# EasyEDA schematic Electronics Sensor& Modules.json

## Sheets
1 3x3 KeyPad: TITLE: Sheet_1; REV: 1.0; Date: 2023-11-17; Sheet: 1/1; Company: Your Company
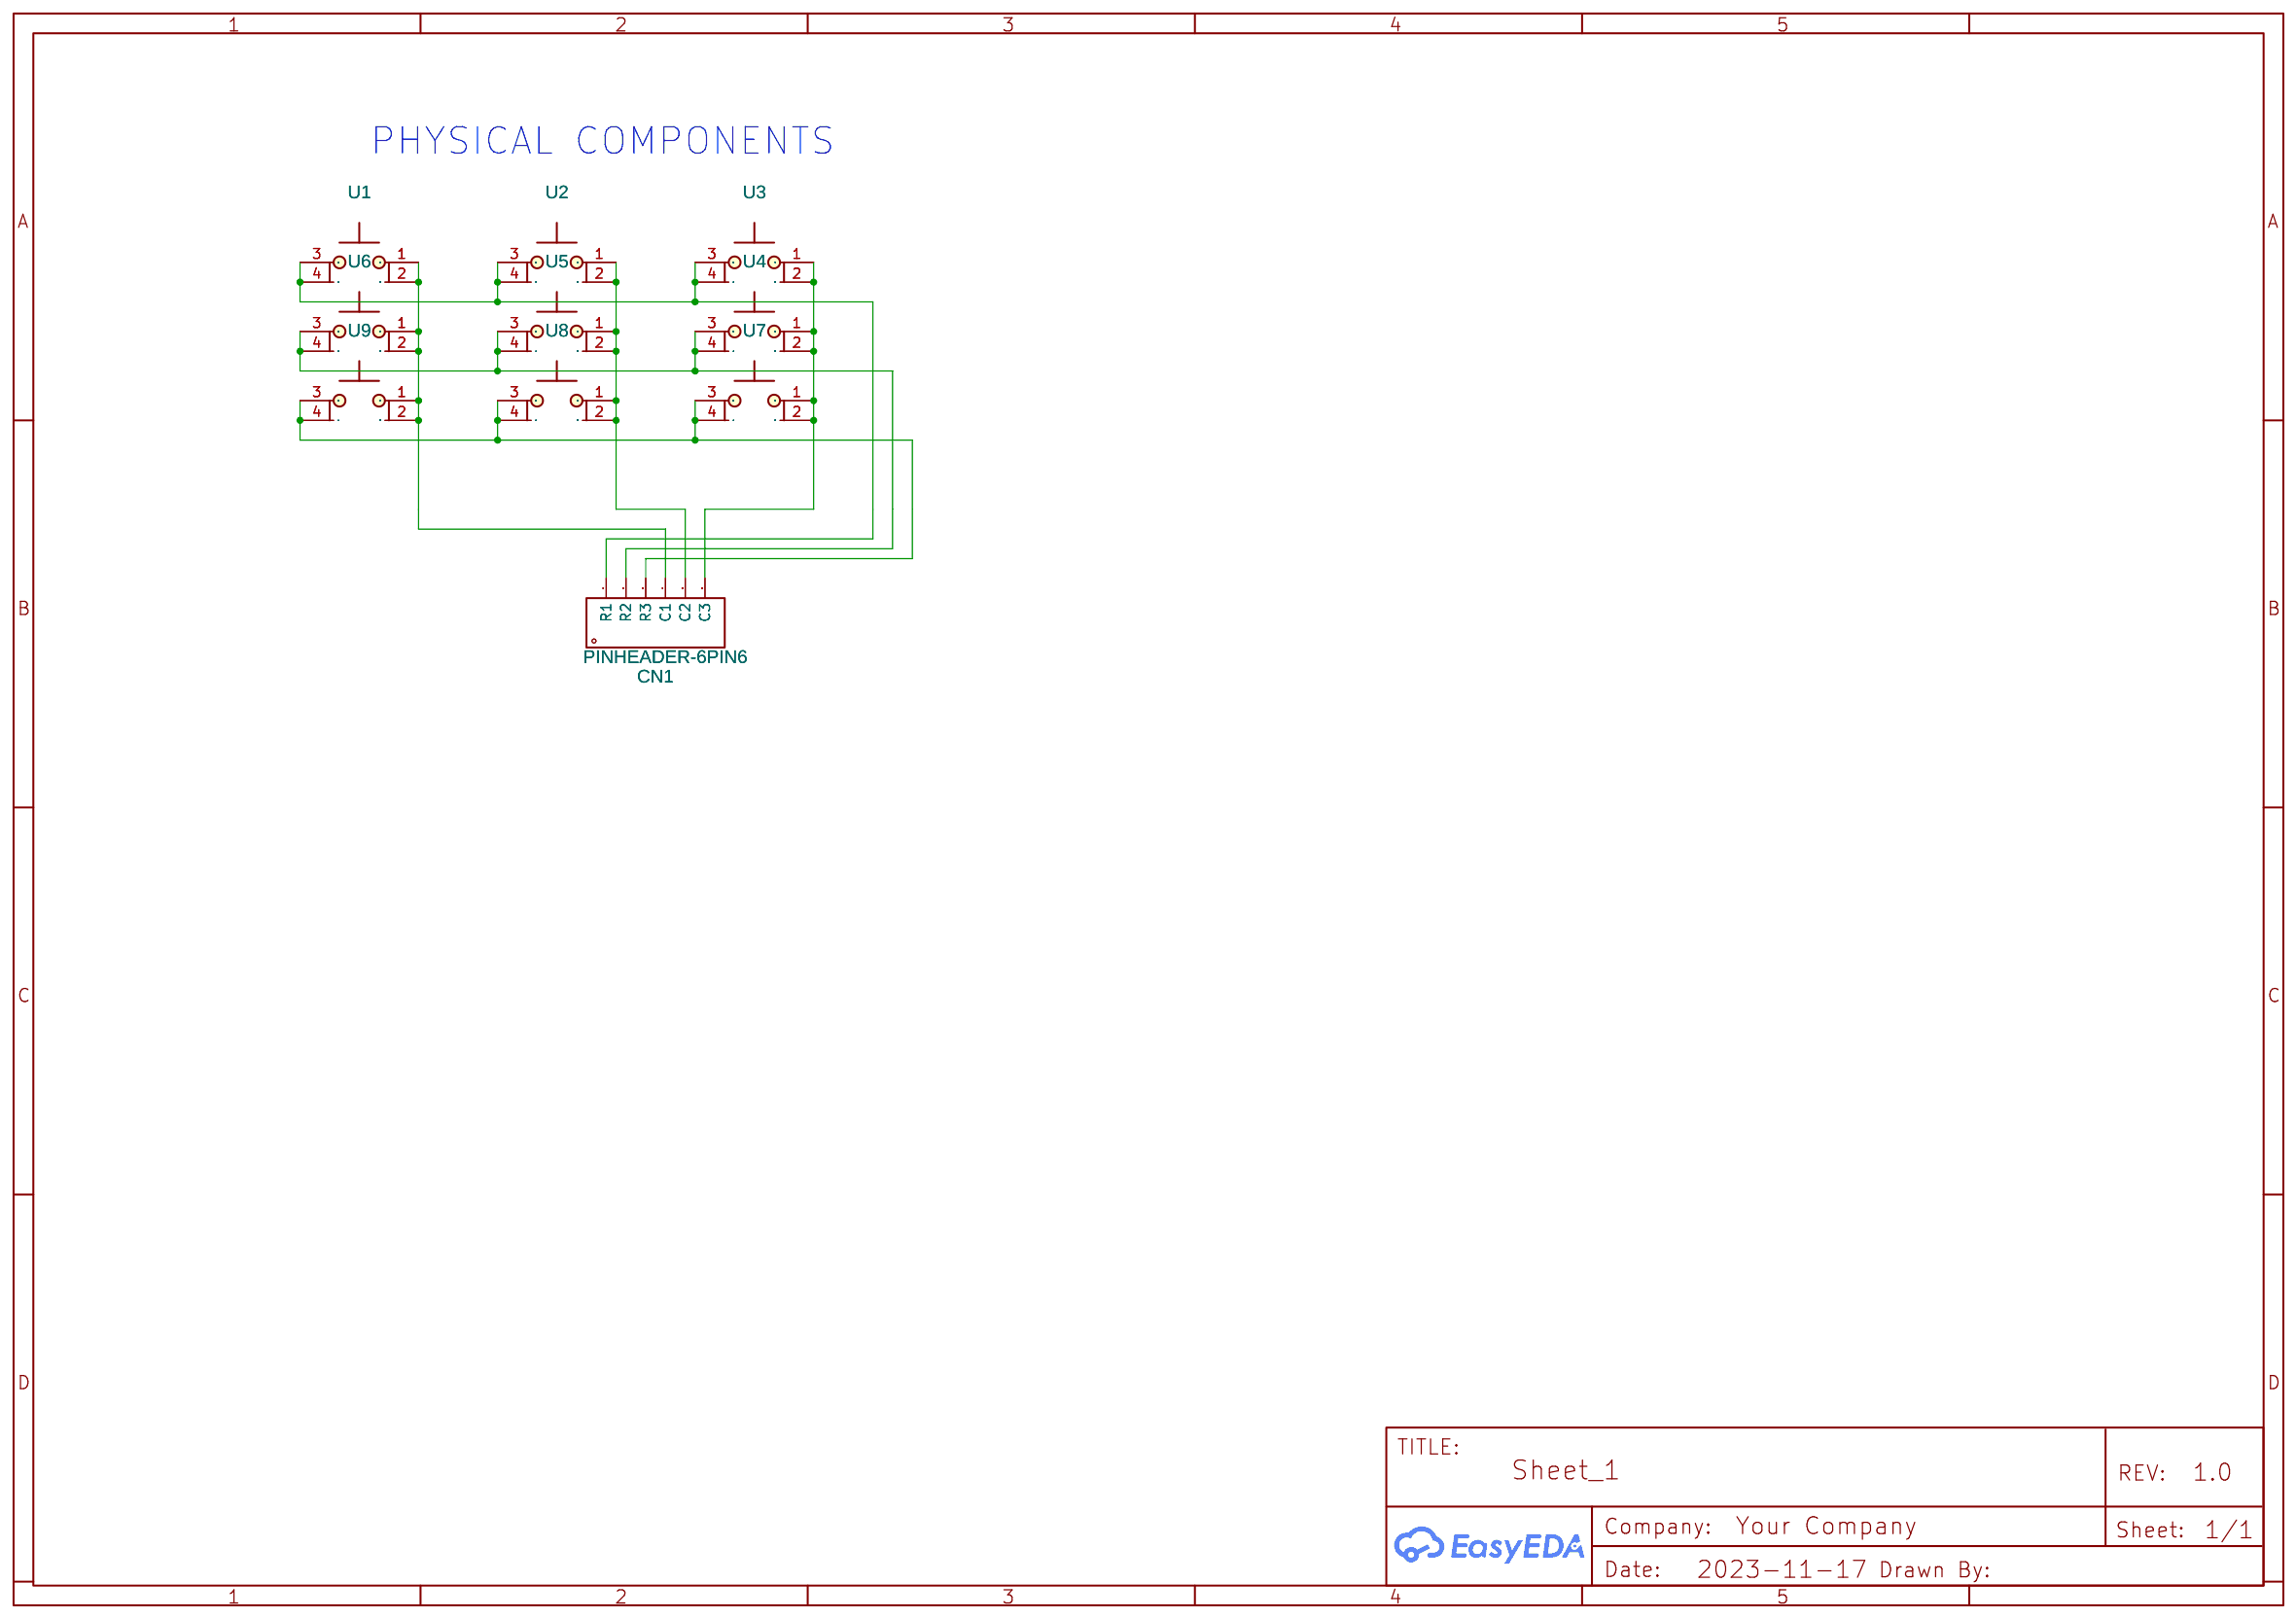
[diagram p0: 3x3 KeyPad]
2 EM-18 Module
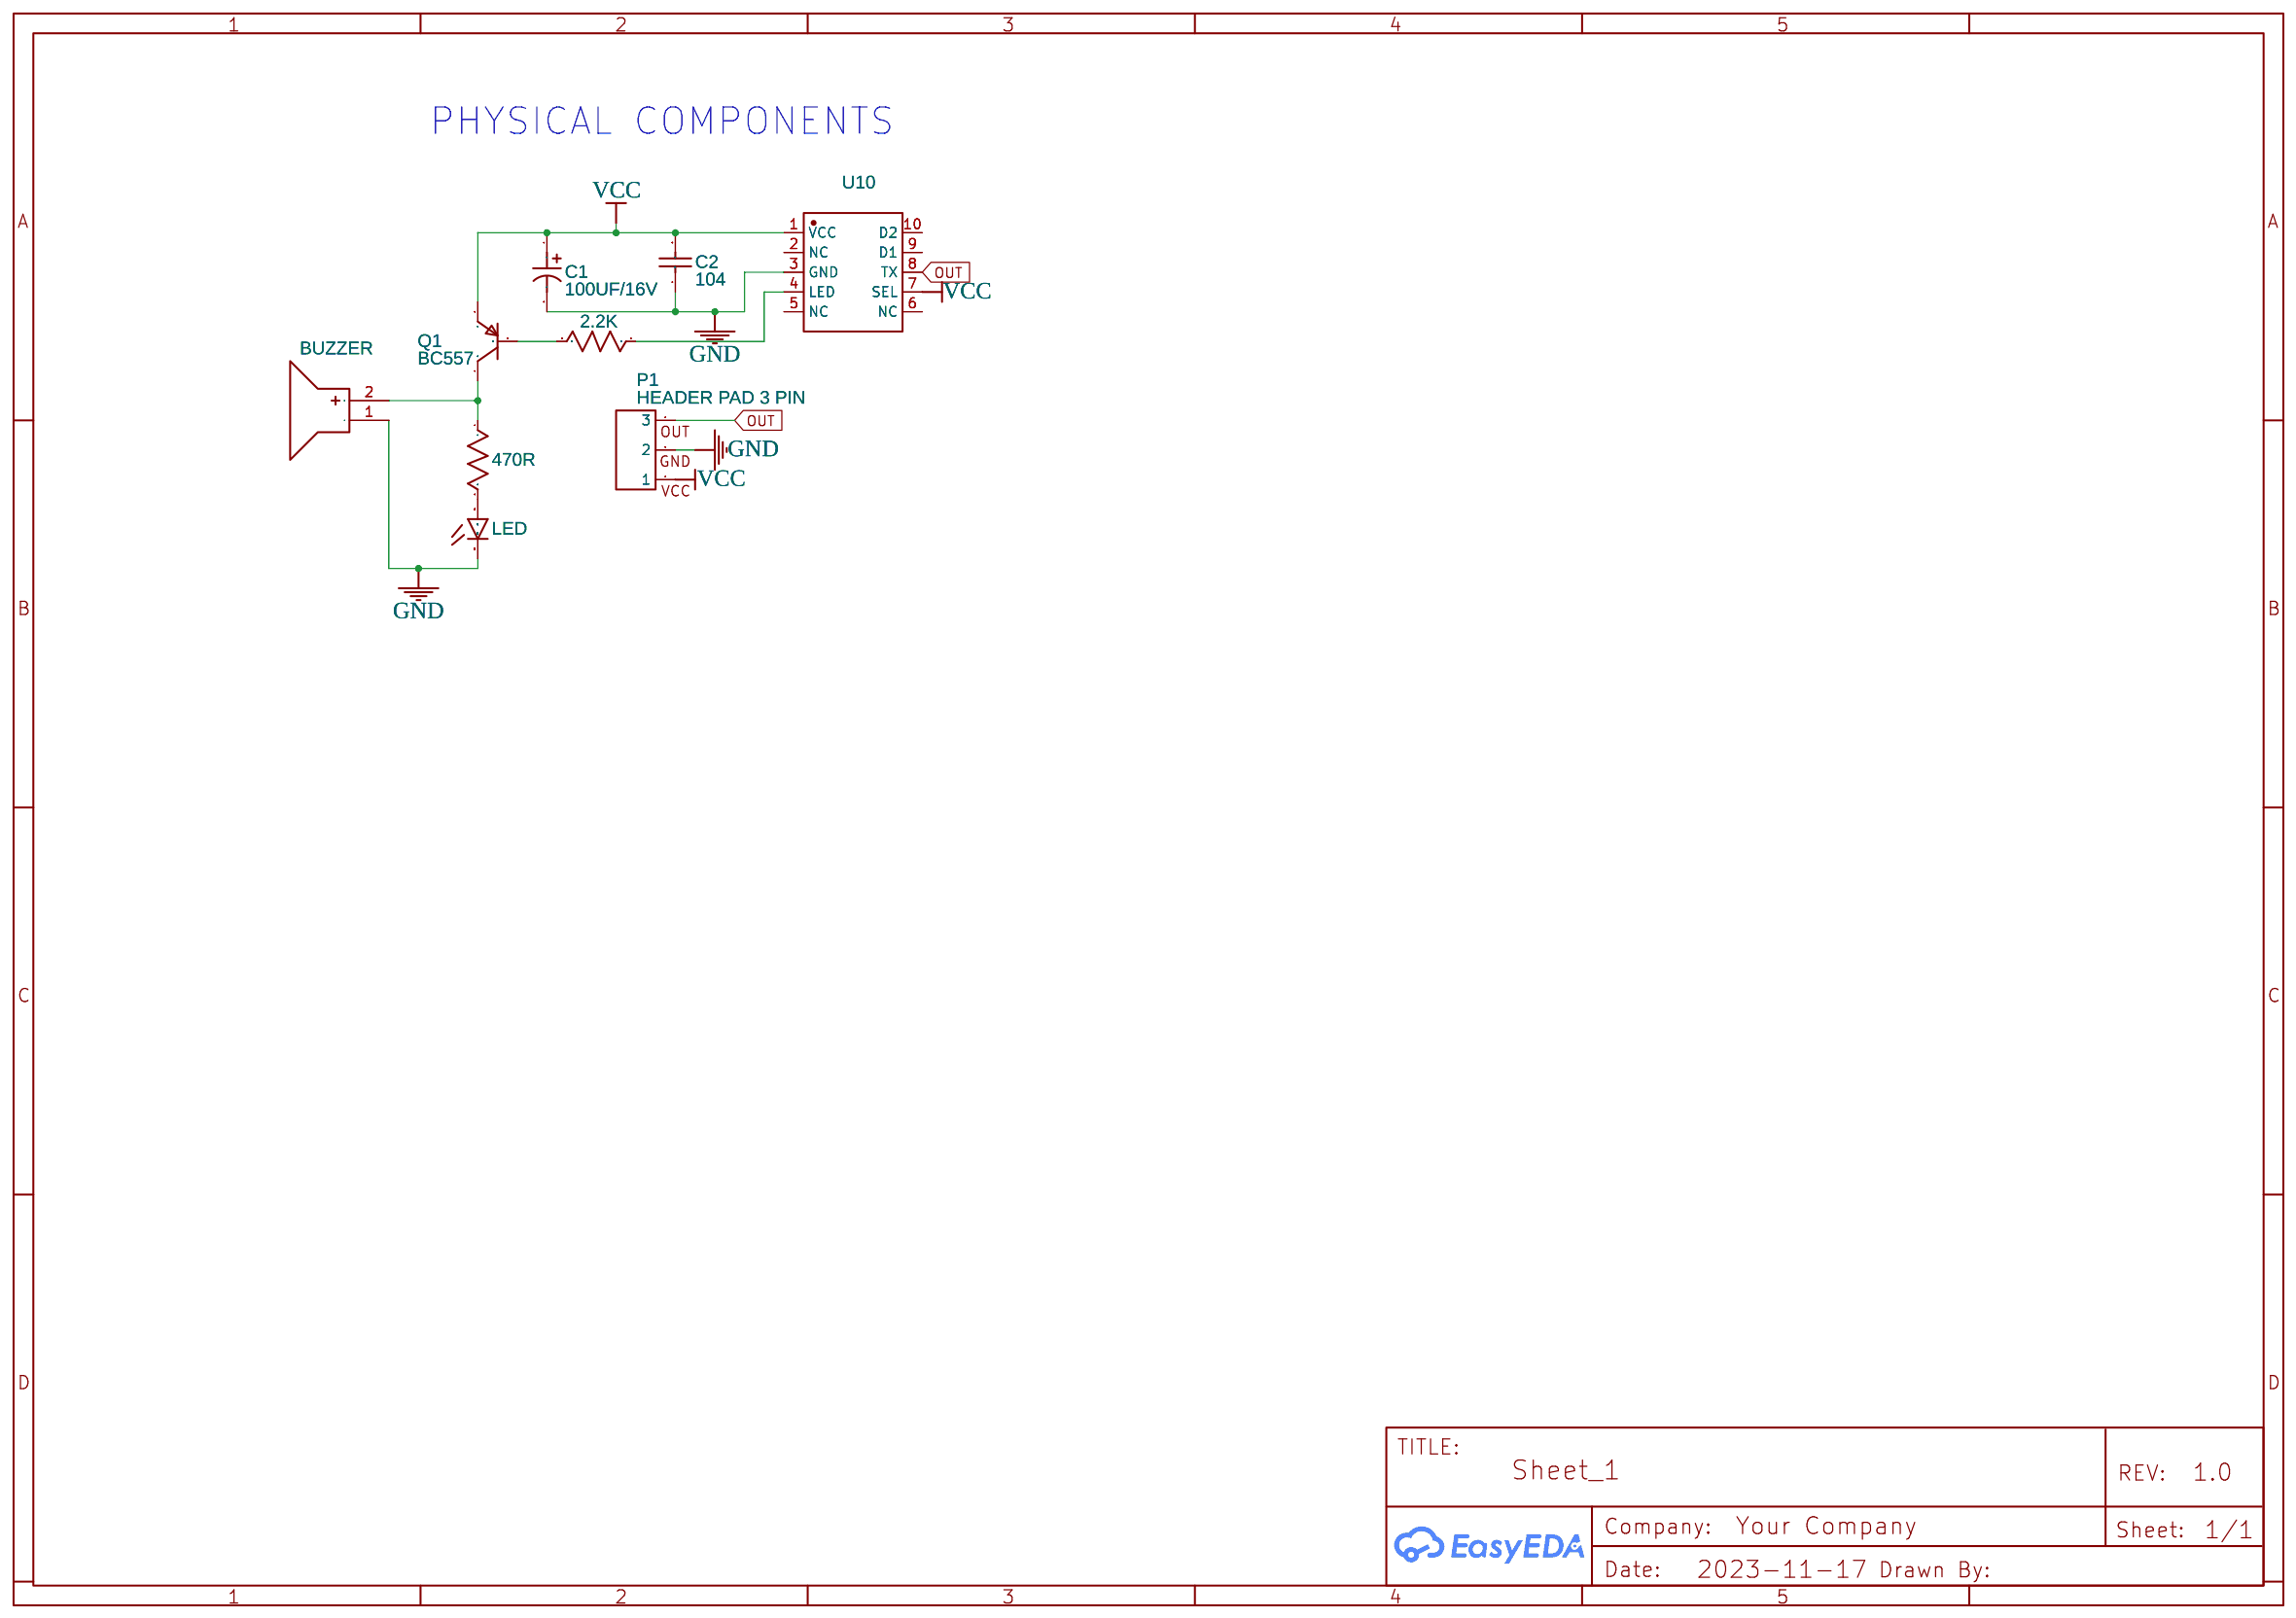
[diagram p1: EM-18 Module]
3 Relay Module
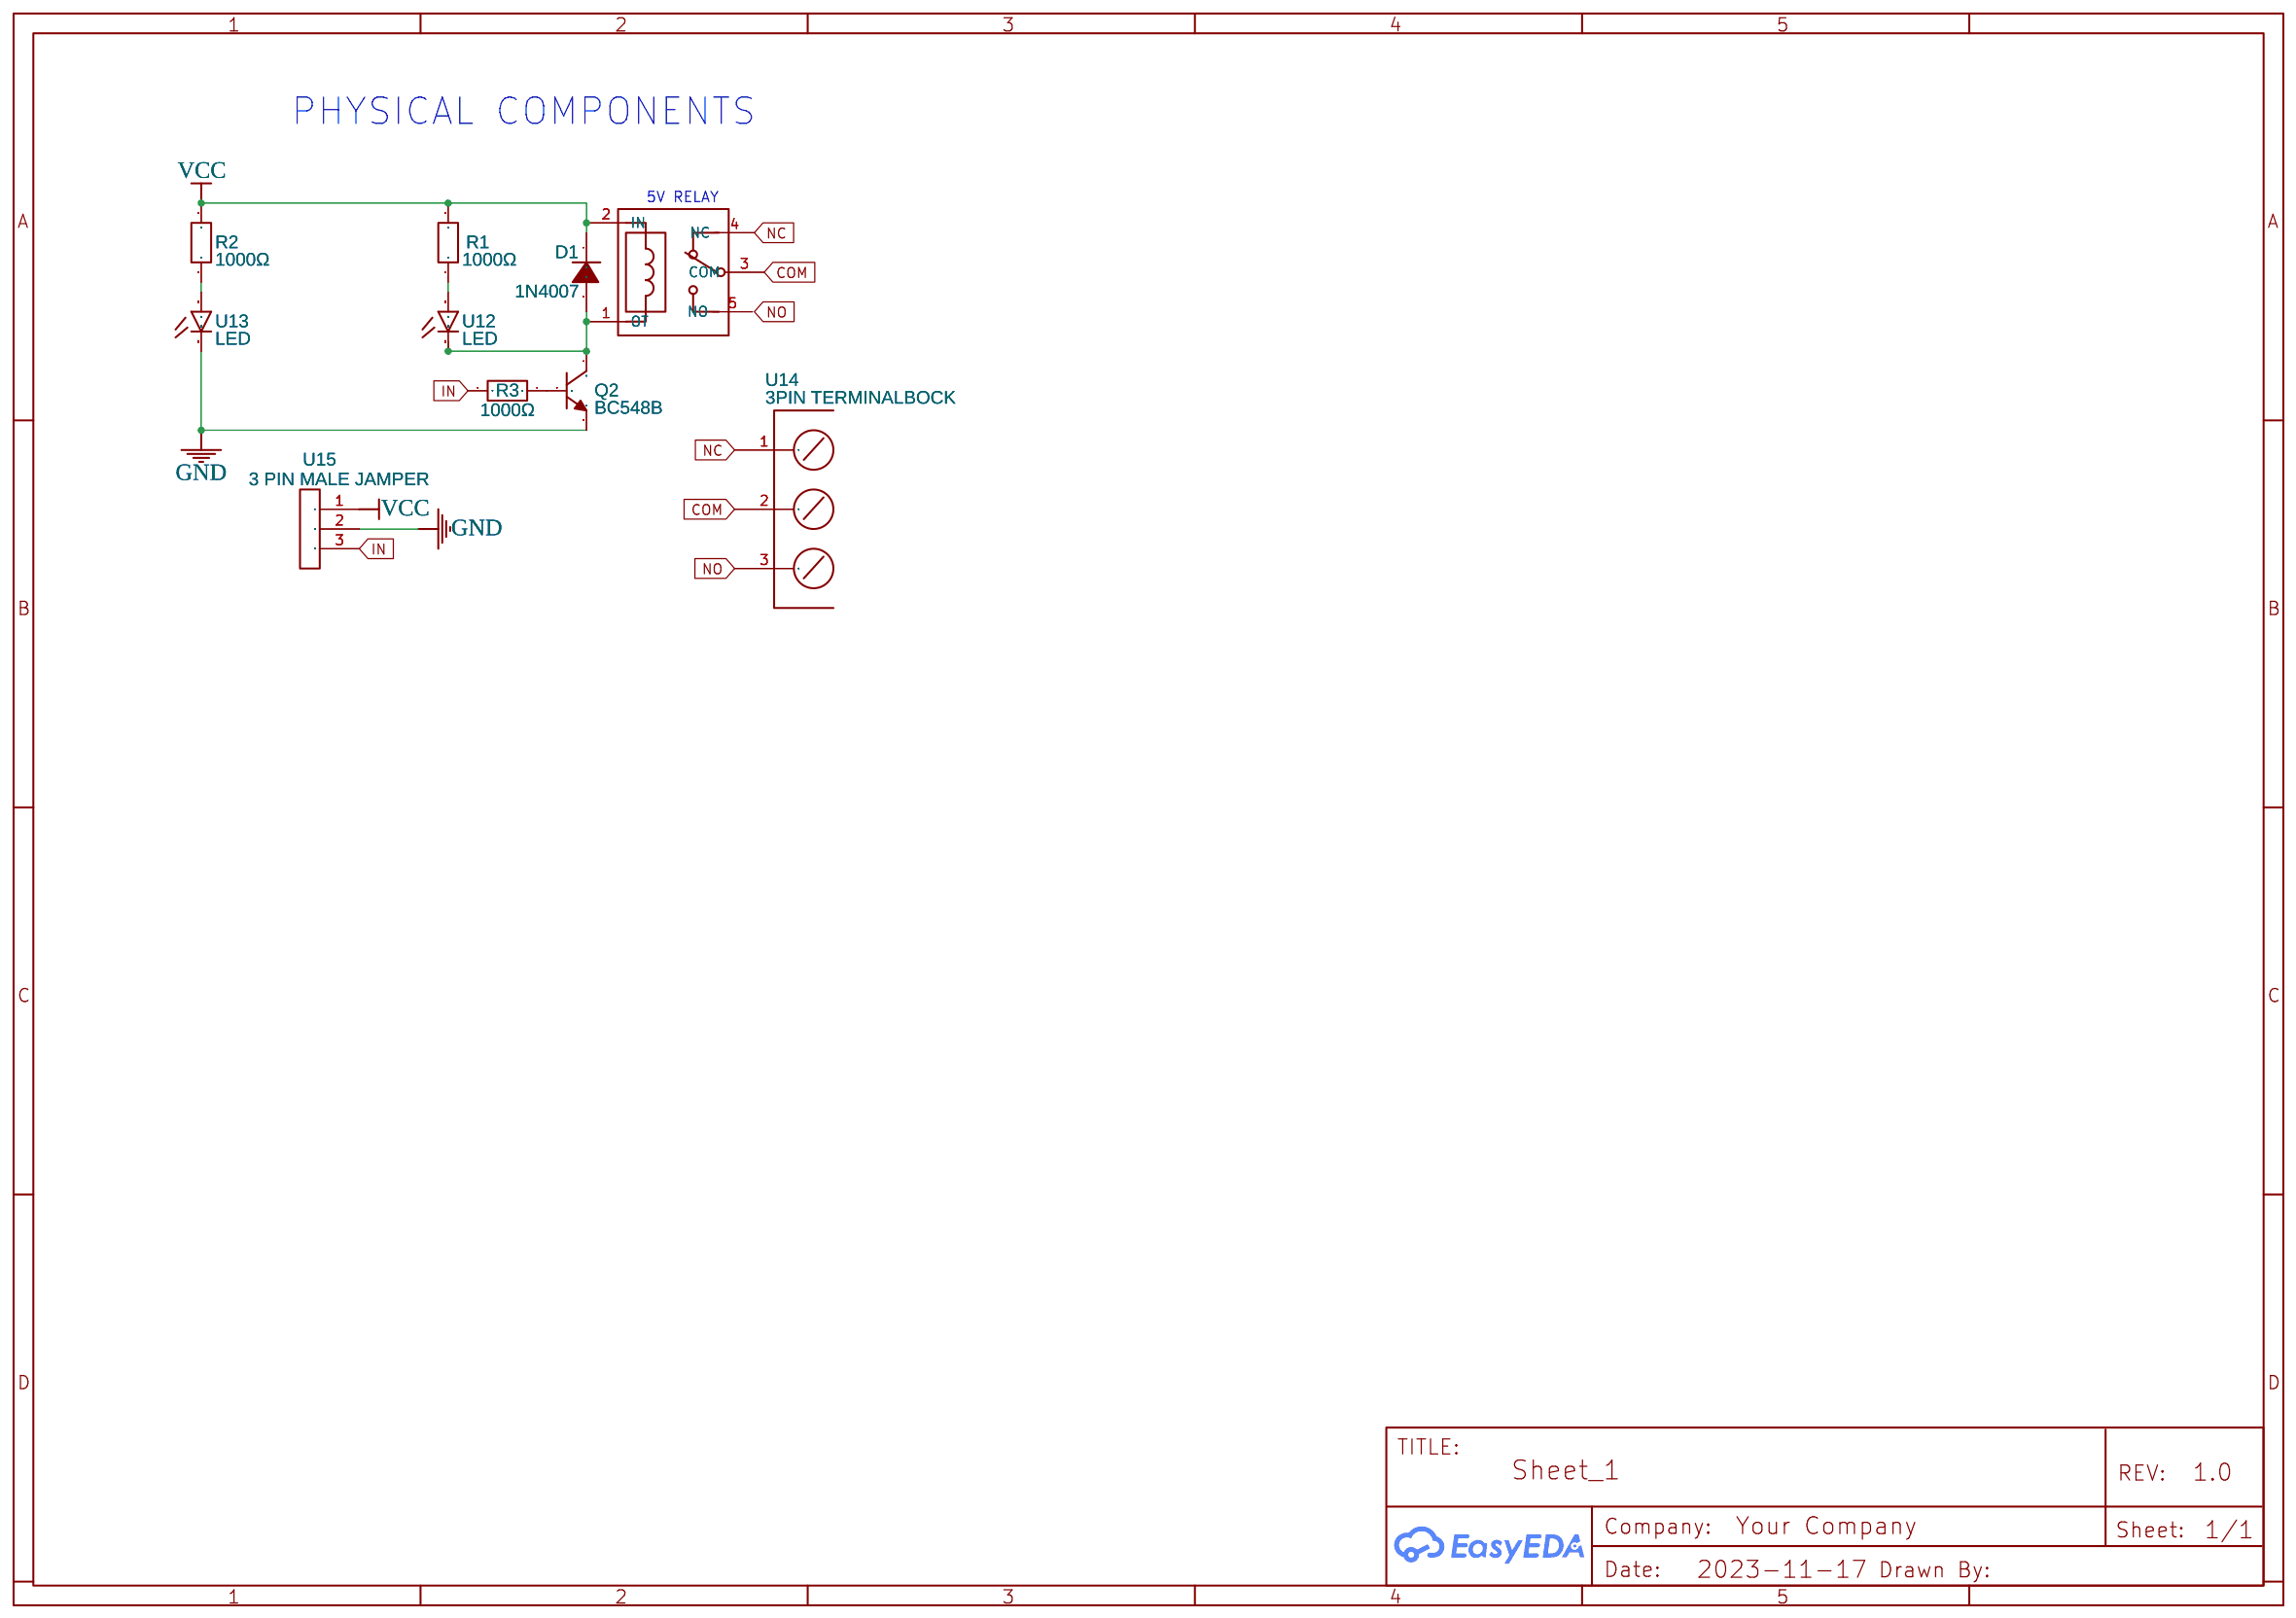
[diagram p2: Relay Module]
4 16x2 LCD Display: Date: 2023-11-18
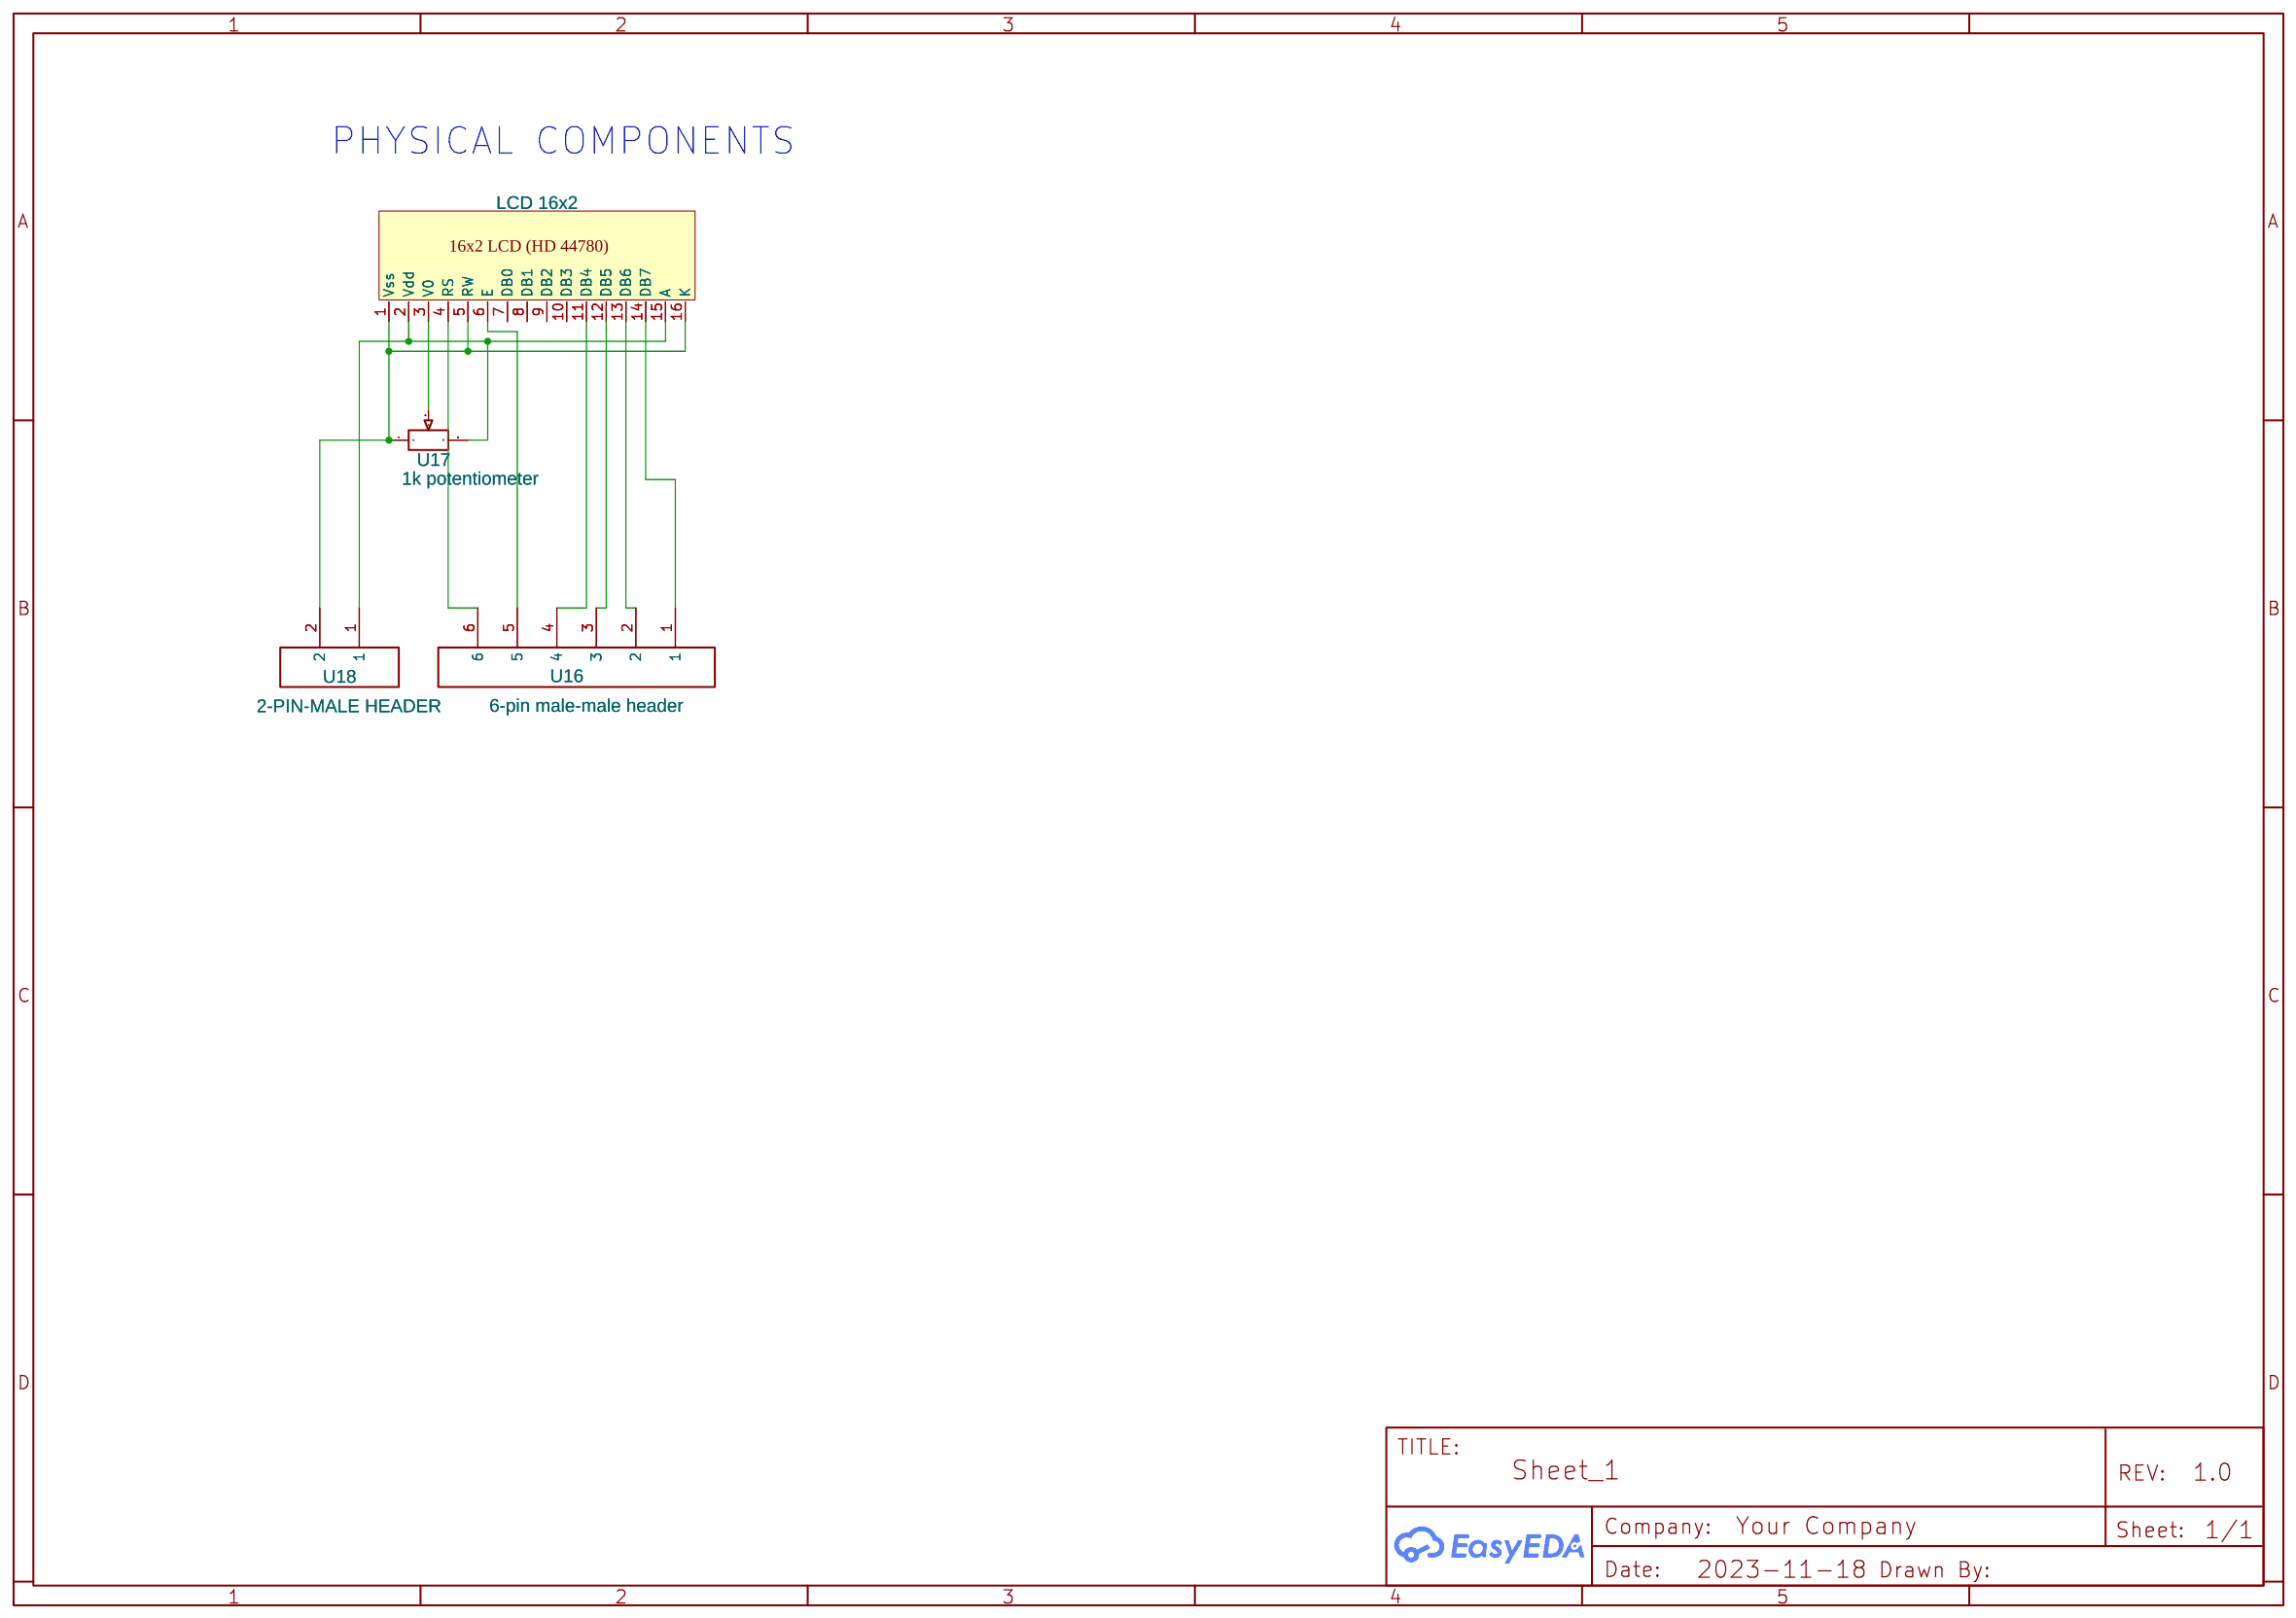
[diagram p3: 16x2 LCD Display]

## Parts
sheet 3x3 KeyPad
CN1  PINHEADER-6PIN6  [PINHEADER-6PIN]
U1  -  [MICROSWITCH]
U2  -  [MICROSWITCH]
U3  -  [MICROSWITCH]
U4  -  [MICROSWITCH]
U5  -  [MICROSWITCH]
U6  -  [MICROSWITCH]
U7  -  [MICROSWITCH]
U8  -  [MICROSWITCH]
U9  -  [MICROSWITCH]
sheet 16x2 LCD Display
LCD1  LCD 16x2  [CLASE10LCD16X2]
U16  6-pin male-male header  [5-PIN MALE-MALE HEADER]
U17  1k potentiometer  [POTENTIOMETER BLUE]
U18  2-PIN-MALE HEADER  [2PIN-MALE HEADER]
sheet EM-18 Module
2.2K  -  [2.2K METAL FILM 1/4W RESISTOR]
470R  -  [2.2K METAL FILM 1/4W RESISTOR]
BUZZER1  BUZZER  [BUZ-TH_BD12.0-P6.00-D0.9-RD]
C1  100UF/16V  [CAP-TH_BD6.3-P2.50-D0.5-FD]
C2  104  [NP CAP-8*3.5-5.08MM]
LED  -  [LED5]
P1  HEADER PAD 3 PIN  [CONNECTOR_PINHEADER_2.54MM:PINHEADER_1X3]
Q1  BC557  [TO-92-3_L4.9-W3.7-P1.27-R]
U10  -  [EM_18]
sheet Relay Module
D1  1N4007  [DO-41_BD2.4-L4.7-P8.70-D0.9-RD]
Q2  BC548B  [TO-92-3_L4.9-W3.7-P1.27-L]
R1  1000Ω  [330Ω RESISTANCE]
R2  1000Ω  [330Ω RESISTANCE]
R3  1000Ω  [330Ω RESISTANCE]
U11  -  [RELAY-TH_SRD-XXVDC-XL-C]
U12  LED  [LED5]
U13  LED  [LED5]
U14  3PIN TERMINALBOCK  [5A_3PIN-TERMINALBLOCK]
U15  3 PIN MALE JAMPER  [3PIN FEMALE HEADER]

## Library data of the parts
CN1 = PINHEADER-6PIN6: Contributor: tiennguyenanh1
U1-U9 = ESO_SPST_Momentary: Contributor: LuckyStiff63; sourceId: F4cICwqI0
LCD1 = LCD 16x2: Contributor: yutthanasing
U16 = 6-pin male-male header: Manufacturer: TE Connectivity; Manufacturer Part: 87224-5; Supplier Part: A26549-ND; link: https://www.digikey.com/en/products/detail/te-connectivity-amp-connectors/87224-5/295324?utm_adgroup=Essen%20Deinki&utm_source=google&utm_medium=cpc&utm_campaign=Shopping_DK%2BSupplier_Other&utm_term=&utm_content=Essen%20Deinki&gclid=EAIaIQobChMIl76j1KPQ9wIVirfICh1BfwQCEAQYASABEgL9fPD_BwE; Contributor: Soumarya
U17 = Pot_blue: Supplier Part: C61836; Contributor: Dennis van der Velde; Convert to PCB: Yes; Add into BOM: Yes
U18 = 2-PIN-MALE HEADER: Manufacturer: TE Connectivity; Manufacturer Part: 87224-5; Supplier Part: A26549-ND; link: https://www.digikey.com/en/products/detail/te-connectivity-amp-connectors/87224-5/295324?utm_adgroup=Essen%20Deinki&utm_source=google&utm_medium=cpc&utm_campaign=Shopping_DK%2BSupplier_Other&utm_term=&utm_content=Essen%20Deinki&gclid=EAIaIQobChMIl76j1KPQ9wIVirfICh1BfwQCEAQYASABEgL9fPD_BwE; Contributor: Soumarya
2.2K 470R = 1/4W-2.2KΩ±1%: Manufacturer: Huaxing Mechanical-Elec.; Supplier: LCSC; Supplier Part: C714002; Contributor: jellybeanstaffy; Convert to PCB: Yes; Add into BOM: Yes
BUZZER1 = BUZZER: Contributor: lcsc; Supplier: LCSC; Supplier Part: C9900014030; Manufacturer: null; Manufacturer Part: buzzer; JLCPCB Part Class: Extended Part; link: https://lcsc.com/eda_search?q=C9900014030&%26type=1&ref=editor
C1 = 100UF/16V: Supplier: LCSC; Supplier Part: C9900021331; Manufacturer: null; Manufacturer Part: 100uF/16V; JLCPCB Part Class: Extended Part; Contributor: lcsc
C2 = 104nf: Supplier: LCSC; Manufacturer: ReliaPro; Manufacturer Part: Suppression Capacitor222M/250V; Supplier Part: C46751; Contributor: sunbin
LED U12 U13 = -LED
P1 = HEADER PAD 3 PIN: Supplier: LCSC; Manufacturer: BOOMELE; Manufacturer Part: Female headerHDR1X8-2.54; Supplier Part: C27438; JLCPCB Part Class: Extended Part; Contributor: vincentboisselier
Q1 = BC557: Contributor: LCSC; Supplier Part: C180418; Supplier: LCSC; Manufacturer: CJ(江苏长电/长晶); JLCPCB Part Class: Extended Part; link: https://lcsc.com/eda_search?q=C180418&%26type=1&ref=editor
U10 = EM-18: Contributor: muhammedimdaad16
D1 = 1N4007: Supplier: LCSC; Manufacturer: ST(先科); Supplier Part: C106903; JLCPCB Part Class: Extended Part; link: https://lcsc.com/eda_search?q=C106903&%26type=1&ref=editor
Q2 = BC548B: Supplier: LCSC; Manufacturer: CJ(江苏长电/长晶); Manufacturer Part: BC548; Supplier Part: C36611; JLCPCB Part Class: Extended Part; link: https://lcsc.com/eda_search?q=C36611&%26type=1&ref=editor
R1-R3 = 330Ω RESISTANCE: Supplier Part: C410657; Supplier: LCSC; Contributor: pritams07
U11 = SRD-05VDC-SL-C: Supplier: LCSC; Manufacturer: 松乐; Supplier Part: C35449; JLCPCB Part Class: Extended Part; Contributor: danishjr.hd
U14 = 3PIN TERMINALBOCK: Contributor: abdullahsesli
U15 = 3 PIN MALE JAMPER: Manufacturer Part: 1x3 pin header; Contributor: SHUBHASHISH; Supplier Part: NA; Manufacturer: NA; link: NA

## Nets
GND: BUZZER1.1(-) C1.2 C2.1 LED.CATHODE P1.2 Q2.3(E) U10.3(GND) U13.CATHODE U15.2
VCC: C1.1 C2.2 D1.1(K) P1.1 Q1.3(E) R1.2 R2.2 U10.1(VCC) U10.7(SEL) U11.2(IN) U15.1
COM: U11.3(COM) U14.2
IN: R3.2 U15.3
NC: U11.4(NC) U14.1
NO: U14.3
OUT: P1.3 U10.8(TX)
Net-(2.2K-1): 2.2K.1 U10.4(LED)
Net-(2.2K-2): 2.2K.2 Q1.2(B)
Net-(470R-1): 470R.1 BUZZER1.2(+) Q1.1(C)
Net-(470R-2): 470R.2 LED.ANODE
Net-(CN1-1): CN1.1(R1) U1.3 U1.4 U2.3 U2.4 U3.3 U3.4
Net-(CN1-2): CN1.2(R2) U4.3 U4.4 U5.3 U5.4 U6.3 U6.4
Net-(CN1-3): CN1.3(R3) U7.3 U7.4 U8.3 U8.4 U9.3 U9.4
Net-(CN1-4): CN1.4(C1) U1.1 U1.2 U6.1 U6.2 U9.1 U9.2
Net-(CN1-5): CN1.5(C2) U2.1 U2.2 U5.1 U5.2 U8.1 U8.2
Net-(CN1-6): CN1.6(C3) U3.1 U3.2 U4.1 U4.2 U7.1 U7.2
Net-(D1-2): D1.2(A) Q2.1(C) U11.1(OT) U12.CATHODE
Net-(LCD1-1): LCD1.1(Vss) LCD1.5(RW) LCD1.16(K) U17.1 U18.2
Net-(LCD1-2): LCD1.2(Vdd) LCD1.15(A) U17.3(2) U18.1
Net-(LCD1-3): LCD1.3(V0) U17.2(3)
Net-(LCD1-4): LCD1.4(RS) U16.6
Net-(LCD1-6): LCD1.6(E) U16.5
Net-(LCD1-11): LCD1.11(DB4) U16.4
Net-(LCD1-12): LCD1.12(DB5) U16.3
Net-(LCD1-13): LCD1.13(DB6) U16.2
Net-(LCD1-14): LCD1.14(DB7) U16.1
Net-(Q2-2): Q2.2(B) R3.1
Net-(R1-1): R1.1 U12.ANODE
Net-(R2-1): R2.1 U13.ANODE

Not connected (* = marked no-connect by the designer): LCD1 7(DB0) 8(DB1) 9(DB2) 10(DB3); U10 2(NC) 5(NC) 6(NC) 9(D1) 10(D2); U11 5(NO)

## Notes on the sheets
sheet 1
- PHYSICAL COMPONENTS
sheet 2
- PHYSICAL COMPONENTS
sheet 3
- PHYSICAL COMPONENTS
- 5V RELAY
sheet 4
- PHYSICAL COMPONENTS
